# EAGLE board OSO-BOOK-A1-05 (EAGLE 9.4.2)
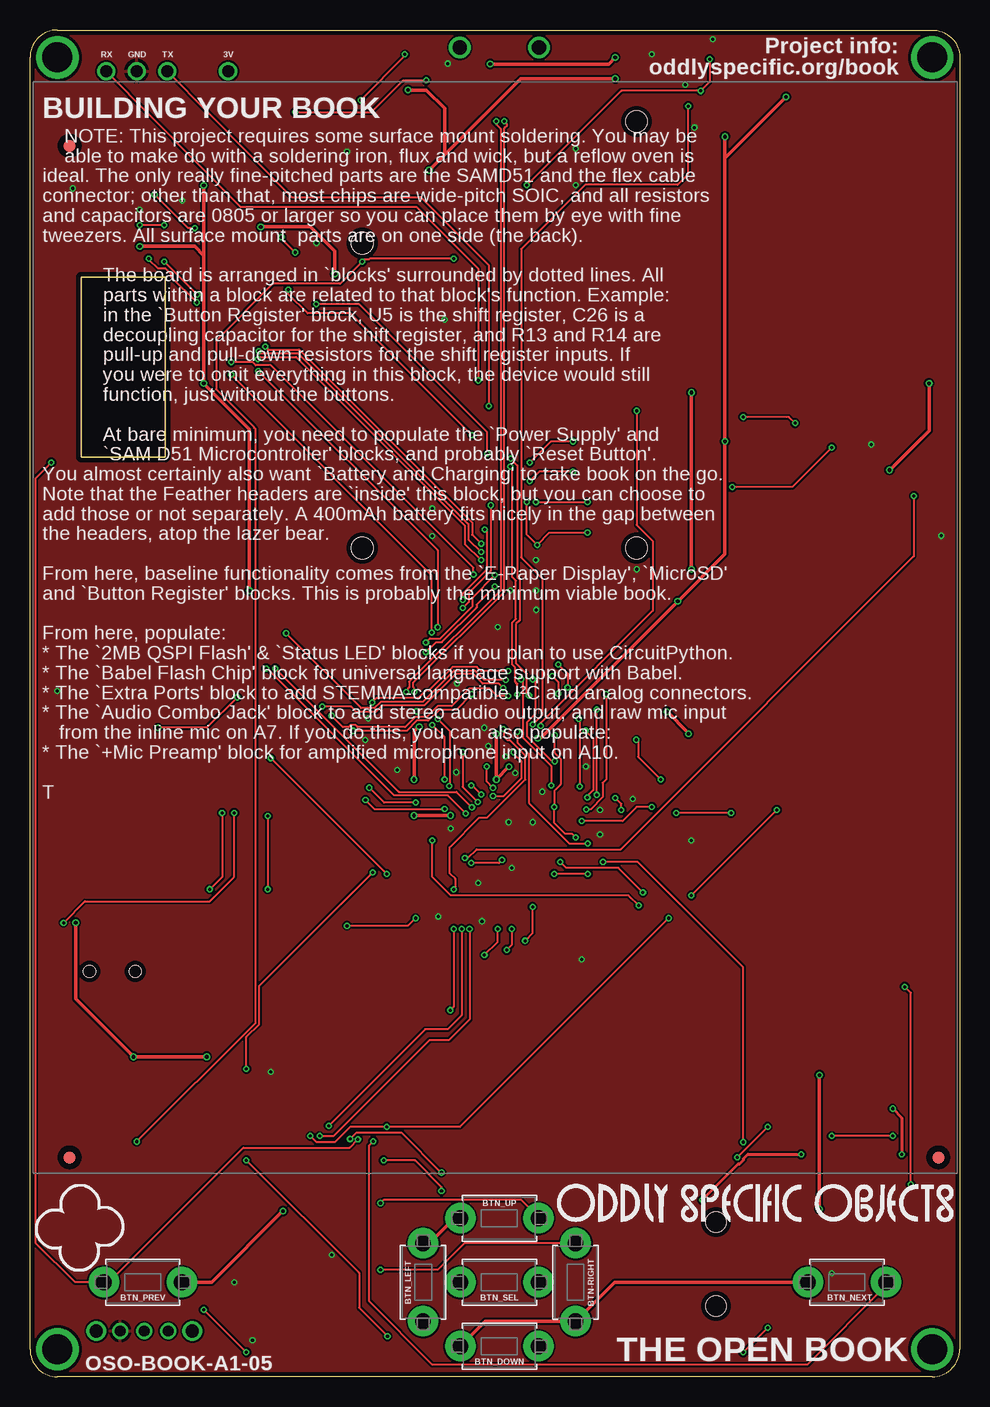
[diagram p3: board, top side]
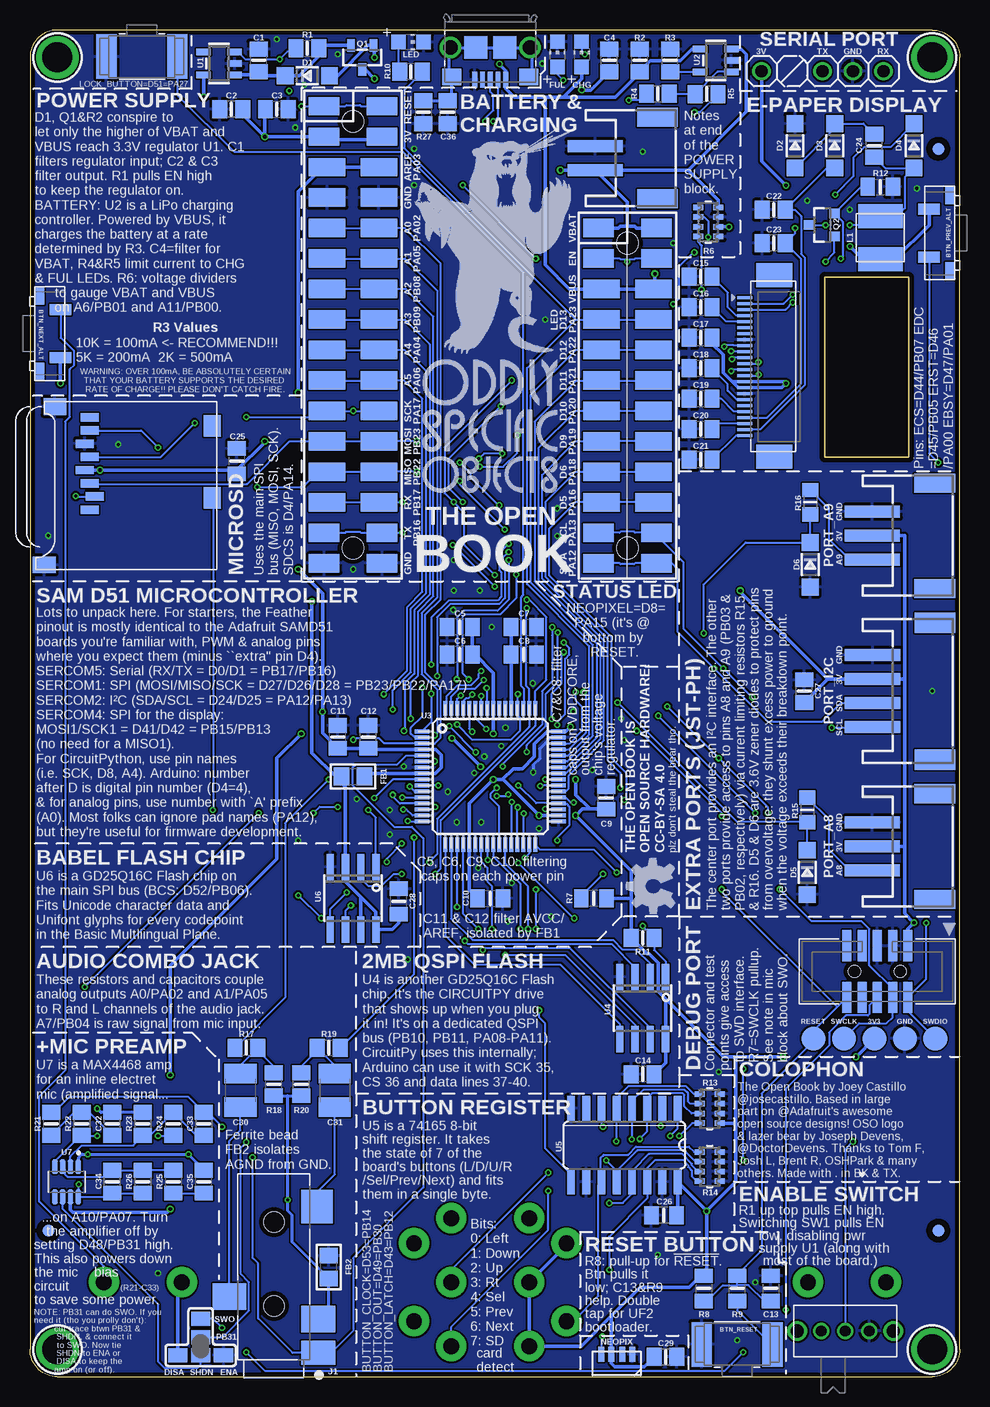
[diagram p4: board, bottom side, seen from below]

Size 77.47 x 112.27 mm. Coordinates in mm from the lower left corner, seen from the top.
Outline: 2.29,112.27 75.18,112.27 arc-90 77.47,109.98 77.47,2.29 arc-90 75.18,0 2.29,0 arc-90 0,2.29 0,109.98 arc-90 2.29,112.27
Copper layers (1*16): Top 0.035559375mm / dielectric 1.6mm / Bottom 0.035559375mm
Design rules "oshpark-2layer *": minimum track width 6mil, minimum drill 10mil, track to track 6mil, track to pad 6mil, pad to pad 6mil, via to via 6mil, smd to smd 6mil, copper to edge 15mil, drill to drill 6mil, minimum pad ring 5mil, minimum via ring 5mil, stop-mask expansion 2.5mil, vias tented up to drill 12mil, thermal gap 10mil
Net classes: 0 default: width 0.152 mm, drill 0.254 mm; 1 power: width 0.305 mm, drill 0.305 mm; 2 gnd: width 0.254 mm, drill 0.254 mm

## Footprints (pad centres in the part's own frame; a part is rotated, then mirrored left to right if it is on the bottom)
TACT_PANA-EVQ = drill 1.3 pad 2.54: P$1 -3.25,0; P$2 3.25,0
BTN_CK_KSS = smd 1.7 x 3.7: P$1 -2.95,0; P$2 2.95,0
0805-NO = smd 1.24 x 1.5: 1 -0.95,0; 2 0.95,0
0805_10MGAP = smd 1.2 x 1.5: 1 -1.05,0; 2 1.05,0
C1210 = smd 1.6 x 2.7: 1 -1.4,0; 2 1.4,0
CHIP-LED0805 = smd 1.2 x 1.2: A 0,-1.05; C 0,1.05
SOD-123 = smd 1.4 x 1.4: A 1.85,0; C -1.85,0
TL3330AF130QG = smd 1.45 x 0.8: MP1 0.75,-2.1; MP2 7.05,-2.1 | smd 0.9 x 1.778: P$1 1.9,-0.346; P$2 5.9,-0.346
0805 = smd 1.3 x 1.5: 1 -0.95,0; 2 0.95,0
FIDUCIAL_1MM = smd 1 x 1: 1 0,0
CUI_SJ-43514-SMT = smd 2 x 2.8: 1 -7.15,-3.7 | smd 2.8 x 2.6: 2 5.05,-3.6 | smd 2.2 x 2.8: 3 -2.45,3.7; 4 -4.35,-3.7 | hole 1.7: -3.25,0; 3.75,0
FCI_10118193-0001LF = smd 0.4 x 1.35: 1 -1.3,2.675; 2 -0.65,2.675; 3 0,2.675; 4 0.65,2.675; 5 1.3,2.675 | smd 1.6 x 1.4: S1 -3.2,2.45; S2 3.2,2.45 | smd 1.9 x 1.9: S3 1.2,0; S4 -1.2,0 | drill 1.2: S5 3.302,0; S6 -3.302,0
1X03 = drill 1.016: 1 -2.54,0; 2 0,0; 3 2.54,0
1X01 = drill 1.016: 1 0,0
MICROBUILDER_INDUCTOR_4X4MM_NR401_BIGPADS = smd 2 x 3.7: P$1 -1.8,0; P$2 1.8,0
MICROSD = smd 0.7 x 1.5: 1 9,-10.64; 2 7.9,-10.24; 3 6.8,-10.64; 4 5.7,-11.04; 5 4.6,-10.64; 6 3.5,-11.04; 7 2.4,-10.64; 8 1.3,-10.64 | smd 1.8 x 1.4: CD1 2,-0.44; CD2 8,-0.44 | smd 1.4 x 1.9: MT1 0.4,-13.54; MT2 13.6,-14.44
FEATHERWING_SMT2 = smd 1.524 x 2.54: 1 6.35,2.413; 1' 6.35,-2.413; 2 8.89,2.413; 2' 8.89,-2.413; 15 41.91,2.413; 15' 41.91,-2.413; 16 44.45,2.413; 16' 44.45,-2.413; 17 44.45,20.447; 17' 44.45,25.273; 18 41.91,20.447; 18' 41.91,25.273; 27 19.05,20.447; 27' 19.05,25.273; 28 16.51,20.447; 28' 16.51,25.273 | smd 1.524 x 3.048: 3 11.43,2.159; 3' 11.43,-2.159; 4 13.97,2.159; 4' 13.97,-2.159; 5 16.51,2.159; 5' 16.51,-2.159; 6 19.05,2.159; 6' 19.05,-2.159; 7 21.59,2.159; 7' 21.59,-2.159; 8 24.13,2.159; 8' 24.13,-2.159; 9 26.67,2.159; 9' 26.67,-2.159; 10 29.21,2.159; 10' 29.21,-2.159; 11 31.75,2.159; 11' 31.75,-2.159; 12 34.29,2.159; 12' 34.29,-2.159; 13 36.83,2.159; 13' 36.83,-2.159; 14 39.37,2.159; 14' 39.37,-2.159; 19 39.37,20.701; 19' 39.37,25.019; 20 36.83,20.701; 20' 36.83,25.019; 21 34.29,20.701; 21' 34.29,25.019; 22 31.75,20.701; 22' 31.75,25.019; 23 29.21,20.701; 23' 29.21,25.019; 24 26.67,20.701; 24' 26.67,25.019; 25 24.13,20.701; 25' 24.13,25.019; 26 21.59,20.701; 26' 21.59,25.019 | hole 1.8: 17.78,22.86; 43.18,22.86; 7.62,0; 43.18,0
WS2812B_4020 = smd 0.5 x 1.25: 1 1.3,-0.75; 2 0.45,-0.75; 3 -0.45,-0.75; 4 -1.3,-0.75
JSTPH3 = smd 1 x 4.6: 1 -2,-2.7; 2 0,-2.7; 3 2,-2.7 | smd 1.6 x 3.4: NC1 -4.4,2.5; NC2 4.4,2.5
JSTPH4 = smd 1 x 4.6: 1 -3,-3.7; 2 -1,-3.7; 3 1,-3.7; 4 3,-3.7 | smd 1.7 x 3.4: NC1 -5.7,1.5; NC2 5.7,1.5
SOT23-R = smd 0.635 x 1.016: 1 -0.95,-1; 2 0.95,-1; 3 0,1
SOT23-3 = smd 0.8 x 0.9: 1 -0.95,-1; 2 0.95,-1; 3 0,1.1
EXBV8V = smd 0.838 x 0.457: 1 -0.838,1.219; 2 -0.838,0.406; 3 -0.838,-0.406; 4 -0.838,-1.219; 5 0.838,-1.219; 6 0.838,-0.406; 7 0.838,0.406; 8 0.838,1.219
_0805MP = smd 1.2 x 1.3: 1 -1.016,0; 2 1.016,0
SOLDERJUMPER_FIVEWAY = smd 1.168 x 1.6: 1 -0.762,0; 2 0.762,0; 3 0.762,-1.905; 4 0.762,1.905; 5 -2.286,0 | smd 0.635 x 0.203: WIRE 0,0
A10767 = drill 1.1: MP1 -4,0; MP2 4,0 | drill 0.9: P$1 -2,0; P$2 0,0; P$3 2,0
TESTPOINT_ROUND_2MM_NO = smd 2 x 2: P$1 0,0
SOT23-5 = smd 0.55 x 1.2: 1 -0.95,-1.3; 2 0,-1.3; 3 0.95,-1.3; 4 0.95,1.3; 5 -0.95,1.3
TQFP64-10X10 = smd 1.2 x 0.3: 1 -5.7,3.75; 2 -5.7,3.25; 3 -5.7,2.75; 4 -5.7,2.25; 5 -5.7,1.75; 6 -5.7,1.25; 7 -5.7,0.75; 8 -5.7,0.25; 9 -5.7,-0.25; 10 -5.7,-0.75; 11 -5.7,-1.25; 12 -5.7,-1.75; 13 -5.7,-2.25; 14 -5.7,-2.75; 15 -5.7,-3.25; 16 -5.7,-3.75; 33 5.7,-3.75; 34 5.7,-3.25; 35 5.7,-2.75; 36 5.7,-2.25; 37 5.7,-1.75; 38 5.7,-1.25; 39 5.7,-0.75; 40 5.7,-0.25; 41 5.7,0.25; 42 5.7,0.75; 43 5.7,1.25; 44 5.7,1.75; 45 5.7,2.25; 46 5.7,2.75; 47 5.7,3.25; 48 5.7,3.75 | smd 0.3 x 1.2: 17 -3.75,-5.7; 18 -3.25,-5.7; 19 -2.75,-5.7; 20 -2.25,-5.7; 21 -1.75,-5.7; 22 -1.25,-5.7; 23 -0.75,-5.7; 24 -0.25,-5.7; 25 0.25,-5.7; 26 0.75,-5.7; 27 1.25,-5.7; 28 1.75,-5.7; 29 2.25,-5.7; 30 2.75,-5.7; 31 3.25,-5.7; 32 3.75,-5.7; 49 3.75,5.7; 50 3.25,5.7; 51 2.75,5.7; 52 2.25,5.7; 53 1.75,5.7; 54 1.25,5.7; 55 0.75,5.7; 56 0.25,5.7; 57 -0.25,5.7; 58 -0.75,5.7; 59 -1.25,5.7; 60 -1.75,5.7; 61 -2.25,5.7; 62 -2.75,5.7; 63 -3.25,5.7; 64 -3.75,5.7
SOIC8_150MIL = smd 0.6 x 2.2: 1 -1.905,-2.6; 2 -0.635,-2.6; 3 0.635,-2.6; 4 1.905,-2.6; 5 1.905,2.6; 6 0.635,2.6; 7 -0.635,2.6; 8 -1.905,2.6
SO16 = smd 0.66 x 2.032: 1 -4.445,-3.073; 2 -3.175,-3.073; 3 -1.905,-3.073; 4 -0.635,-3.073; 5 0.635,-3.073; 6 1.905,-3.073; 7 3.175,-3.073; 8 4.445,-3.073; 9 4.445,3.073; 10 3.175,3.073; 11 1.905,3.073; 12 0.635,3.073; 13 -0.635,3.073; 14 -1.905,3.073; 15 -3.175,3.073; 16 -4.445,3.073
MICROBUILDER_SOIC8_150MIL = smd 0.6 x 2.2: 1 -1.905,-2.6; 2 -0.635,-2.6; 3 0.635,-2.6; 4 1.905,-2.6; 5 1.905,2.6; 6 0.635,2.6; 7 -0.635,2.6; 8 -1.905,2.6
SOT65P280X145-8N = smd 1.21 x 0.48: 1 -1.255,0.975; 2 -1.255,0.325; 3 -1.255,-0.325; 4 -1.255,-0.975; 5 1.255,-0.975; 6 1.255,-0.325; 7 1.255,0.325; 8 1.255,0.975
MOUNTINGHOLE_2.5_PLATED = drill 2.5 pad 3.2: P$1 0,0
EINK_DISPLAY_4_2IN = smd 1.25 x 0.275 bottom: 1 17.653,-16.717; 2 17.653,-17.217; 3 17.653,-17.717; 4 17.653,-18.217; 5 17.653,-18.717; 6 17.653,-19.217; 7 17.653,-19.717; 8 17.653,-20.217; 9 17.653,-20.717; 10 17.653,-21.217; 11 17.653,-21.717; 12 17.653,-22.217; 13 17.653,-22.717; 14 17.653,-23.217; 15 17.653,-23.717; 16 17.653,-24.217; 17 17.653,-24.717; 18 17.653,-25.217; 19 17.653,-25.717; 20 17.653,-26.217; 21 17.653,-26.717; 22 17.653,-27.217; 23 17.653,-27.717; 24 17.653,-28.217 | smd 3 x 2 bottom: SPRT1 15.193,-14.867; SPRT2 15.193,-29.977
JSTPH2 = smd 1 x 4.6: 1 -1,-3.7; 2 1,-3.7 | smd 1.6 x 3.4: NC1 -3.4,1.5; NC2 3.4,1.5
2X05_1.27MM_BOX_POSTS = smd 0.76 x 2.6: 1 -2.54,-2.15; 2 -2.54,2.15; 3 -1.27,-2.15; 4 -1.27,2.15; 5 0,-2.15; 6 0,2.15; 7 1.27,-2.15; 8 1.27,2.15; 9 2.54,-2.15; 10 2.54,2.15 | hole 1: -1.905,0; 1.905,0

## Placement (x,y rotation side)
BTN-RIGHT  [TACT_PANA-EVQ]  45.47,7.87 270 top
BTN_DOWN  [TACT_PANA-EVQ]  39.12,2.54 180 top
BTN_LEFT  [TACT_PANA-EVQ]  32.77,7.87 90 top
BTN_LOCK  [BTN_CK_KSS]  68.15,110.06 180 bottom
BTN_NEXT  [TACT_PANA-EVQ]  68.07,7.87 180 top
BTN_PREV  [TACT_PANA-EVQ]  9.4,7.87 0 top
BTN_RESET  [BTN_CK_KSS]  18.54,2.69 0 bottom
BTN_SEL  [TACT_PANA-EVQ]  39.12,7.87 180 top
BTN_UP  [TACT_PANA-EVQ]  39.12,13.21 180 top
C1  10µF  [0805-NO]  58.42,109.73 90 bottom
C2  10µF  [0805-NO]  60.71,105.66 180 bottom
C3  1uF  [0805-NO]  56.9,105.66 0 bottom
C4  10µF  [0805-NO]  29.21,109.73 90 bottom
C5  10uF  [0805_10MGAP]  41.66,62.48 180 bottom
C6  1uF  [0805_10MGAP]  41.66,60.2 180 bottom
C7  10uF  [0805_10MGAP]  36.32,62.48 0 bottom
C8  1uF  [0805_10MGAP]  36.32,60.2 0 bottom
C9  1uF  [0805-NO]  29.46,48.26 90 bottom
C10  1uF  [0805_10MGAP]  39.12,39.88 0 bottom
C11  10µF  [0805-NO]  51.82,53.34 90 bottom
C12  1uF  [0805-NO]  49.28,53.34 90 bottom
C13  0.1uF  [0805_10MGAP]  15.75,7.37 270 bottom
C14  1uF  [0805-NO]  26.42,25.22 180 bottom
C15  1uF  [0805-NO]  21.59,91.69 0 bottom
C16  1uF  [0805-NO]  21.59,89.15 0 bottom
C17  1uF  [0805-NO]  21.59,86.61 0 bottom
C18  1uF/25V  [0805-NO]  21.59,84.07 0 bottom
C19  1uF/25V  [0805-NO]  21.59,81.53 0 bottom
C20  1uF/25V  [0805-NO]  21.59,78.99 0 bottom
C21  1uF/25V  [0805-NO]  21.59,76.45 0 bottom
C22  1uF/25V  [0805-NO]  15.49,97.28 180 bottom
C23  1uF/25V  [0805-NO]  15.49,94.49 180 bottom
C24  4.7uF/25V  [0805-NO]  7.11,102.62 90 bottom
C25  10uF  [0805_10MGAP]  60.22,76.33 90 bottom
C26  1uF  [0805_10MGAP]  24.64,13.46 180 bottom
C27  10uF  [0805-NO]  12.95,57.15 90 bottom
C28  1uF  [0805_10MGAP]  46.74,39.62 90 bottom
C29  1uF  [0805-NO]  24.51,1.65 0 bottom
C30  100uF  [C1210]  59.94,23.88 270 bottom
C31  100uF  [C1210]  52.07,23.88 270 bottom
C32  0.1µF  [0805-NO]  70.61,21.08 90 bottom
C33  0.01uF  [0805-NO]  62.99,21.08 270 bottom
C34  100pF  [0805-NO]  70.61,16.26 90 bottom
C35  10uF  [0805-NO]  62.99,16.26 90 bottom
C36  4.5nF  [0805-NO]  42.67,105.41 270 bottom
CHG  AMBER  [CHIP-LED0805]  31.5,110.24 0 bottom
D1  MBR120  [SOD-123]  54.36,108.46 0 bottom
D2  MBR0530  [SOD-123]  13.72,102.62 270 bottom
D3  MBR0530  [SOD-123]  10.41,102.62 270 bottom
D4  MBR0530  [SOD-123]  3.81,102.62 270 bottom
D5  3.6V  [SOD-123]  12.7,42.04 270 bottom
D6  3.6V  [SOD-123]  12.45,67.69 270 bottom
DNP_NEXT_ALT  SPST_TACTILE_SWITCHRA  [TL3330AF130QG]  74.57,90.86 270 bottom
DNP_PREV_ALT  SPST_TACTILE_SWITCHRA  [TL3330AF130QG]  2.9,91.44 90 bottom
FB1  Ferrite  [0805]  50.55,50.04 0 bottom
FB2  Ferrite  [0805]  52.58,9.14 90 bottom
FID1  FIDUCIAL_1MM  [FIDUCIAL_1MM]  75.95,12.19 0 bottom
FID2  FIDUCIAL_1MM  [FIDUCIAL_1MM]  75.69,18.29 0 top
FID3  FIDUCIAL_1MM  [FIDUCIAL_1MM]  1.78,102.36 0 bottom
FID4  FIDUCIAL_1MM  [FIDUCIAL_1MM]  3.3,102.62 0 top
FID5  FIDUCIAL_1MM  [FIDUCIAL_1MM]  1.78,12.19 0 bottom
FID6  FIDUCIAL_1MM  [FIDUCIAL_1MM]  3.3,18.29 0 top
FUL  GREEN  [CHIP-LED0805]  33.53,110.24 0 bottom
GOLD_ORB_SM1  OSHWLOGOLOGO5MM  [OSHW_5MM]  25.53,40.89 90 bottom
J1  SJ-43514-SMT  [CUI_SJ-43514-SMT]  57.15,9.14 90 bottom
J2  10118193-0001LF  [FCI_10118193-0001LF]  39.12,110.81 180 bottom
JP1  [1X03]  8.89,108.84 0 bottom
JP2  [1X01]  16.51,108.84 0 bottom
L1  10uH  [MICROBUILDER_INDUCTOR_4X4MM_NR401_BIGPADS]  6.6,94.95 90 bottom
LED  RED  [CHIP-LED0805]  45.72,111.25 270 bottom
MICROSD  MICROSD  [MICROSD]  61.85,81.28 270 bottom
MS1  FEATHERWING_SMTDUAL  [FEATHERWING_SMT2]  50.55,112.27 270 bottom
NEOPIX  WS2812B_4020  [WS2812B_4020]  28.58,1.12 180 bottom
PORT_A8  JST PH 3  [JSTPH3]  4.57,44.2 270 bottom
PORT_A9  JST PH 3  [JSTPH3]  4.57,70.1 270 bottom
PORT_I2C  JST PH 4  [JSTPH4]  3.56,57.15 270 bottom
Q1  DMG341  [SOT23-R]  49.78,109.98 180 bottom
Q2  IRLML0100  [SOT23-3]  11.43,96.01 90 bottom
R1  10K  [0805-NO]  54.36,110.74 0 bottom
R2  100K  [0805-NO]  26.67,109.73 90 bottom
R3  10K  [0805-NO]  24.13,109.73 90 bottom
R4  1K  [0805-NO]  25.15,106.96 0 bottom
R5  1K  [0805-NO]  21.08,106.93 180 bottom
R6  100K  [EXBV8V]  20.96,96.27 0 bottom
R7  10K  [0805_10MGAP]  30.48,39.88 180 bottom
R8  10K  [0805_10MGAP]  21.34,7.37 270 bottom
R9  100  [0805_10MGAP]  18.54,7.37 90 bottom
R10  1K  [0805-NO]  45.72,108.79 180 bottom
R11  100K  [0805-NO]  26.42,36.58 0 bottom
R12  0.47ohm  [0805_10MGAP]  6.6,99.19 0 bottom
R13  100K  [EXBV8V]  20.83,22.35 0 bottom
R14  100K  [EXBV8V]  20.83,17.53 0 bottom
R15  1K  [_0805MP]  12.7,47.24 270 bottom
R16  1K  [_0805MP]  12.45,72.9 270 bottom
R17  100  [0805-NO]  59.44,27.43 180 bottom
R18  100  [0805-NO]  57.15,24.38 90 bottom
R19  100  [0805-NO]  52.58,27.43 0 bottom
R20  100  [0805-NO]  54.86,24.38 90 bottom
R21  1K  [0805-NO]  75.69,21.08 270 bottom
R22  1K  [0805-NO]  73.15,21.08 270 bottom
R23  1M  [0805-NO]  68.07,21.08 270 bottom
R24  1M  [0805-NO]  65.53,21.08 270 bottom
R25  1K  [0805-NO]  65.53,16.26 270 bottom
R26  100K  [0805-NO]  68.07,16.26 270 bottom
R27  1M  [0805-NO]  44.7,105.41 270 bottom
SJ1  SOLDERJUMPER_FIVEWAY  [SOLDERJUMPER_FIVEWAY]  63.25,2.54 270 bottom
SW1  SPDT_SWITCH  [A10767]  9.53,3.81 0 bottom
TP1  [TESTPOINT_ROUND_2MM_NO]  4.57,28.19 180 bottom
TP2  [TESTPOINT_ROUND_2MM_NO]  7.11,28.19 180 bottom
TP6  [TESTPOINT_ROUND_2MM_NO]  9.65,28.19 180 bottom
TP7  [TESTPOINT_ROUND_2MM_NO]  2.03,28.19 180 bottom
TP8  [TESTPOINT_ROUND_2MM_NO]  12.19,28.19 180 bottom
U1  AP2112-3.3  [SOT23-5]  61.72,109.47 90 bottom
U2  MCP73831T-2ACI/OT  [SOT23-5]  20.32,109.73 90 bottom
U3  ATSAMD51J64-TQFP(10X10)  [TQFP64-10X10]  39.12,50.04 0 bottom
U4  GD25Q16C (or GD25Q32C)  [SOIC8_150MIL]  26.42,30.73 180 bottom
U5  74AC165D  [SO16]  27.94,19.3 180 bottom
U6  GD25Q16C (or GD25Q32C)  [MICROBUILDER_SOIC8_150MIL]  50.55,39.88 180 bottom
U7  MAX4468EKAT  [SOT65P280X145-8N]  74.42,16.26 270 bottom
U$1  MOUNTINGHOLE2.5  [MOUNTINGHOLE_2.5_PLATED]  2.29,2.29 0 bottom
U$2  WAVESHARE_4_2_INCH_EINK_DISPLAY  [EINK_DISPLAY_4_2IN]  0.25,106.68 0 top
U$4  MOUNTINGHOLE2.5  [MOUNTINGHOLE_2.5_PLATED]  75.18,2.29 0 bottom
U$5  MOUNTINGHOLE2.5  [MOUNTINGHOLE_2.5_PLATED]  2.29,109.98 0 bottom
U$7  MOUNTINGHOLE2.5  [MOUNTINGHOLE_2.5_PLATED]  75.18,109.98 0 bottom
U$45  [OSO_WORDMARK_125X1300MIL_1000DPI]  43.94,14.48 0 top
U$47  [OSO_BEAR_525X750MIL_1000DPI]  38.86,94.74 0 bottom
U$48  [OSO-LOGO-250MIL]  4.06,12.45 45 top
U$49  [OSO_WORDMARK_THREELINE_450MIL_1000DPI]  39.12,79.25 0 bottom
X1  JSTPH  [JSTPH2]  26.67,101.6 270 bottom
X2  2x5 0.05" SWD  [2X05_1.27MM_BOX_POSTS]  6.86,33.78 180 bottom

## Tracks (layer width: path | path; a pad name or v marks a point on that pad's centre or on a via)
!RESET  (via drill 0.25)
  Top 0.152: v41.88,54.36 42.67,55.14 42.67,66.55 40.92,68.3 40.92,94 46.27,99.35 53.96,99.35 54.86,100.25 v54.86,105.92 | v36.81,56.9 35.51,55.6 34.09,55.6 33.17,54.69 32.23,54.69 31.39,53.85 v26.92,53.85 | v19.81,46.74 v19.81,40.64
  Bottom 0.152: MS1.1 49.9,105.92 49.98,106 51.11,106 51.2,105.92 MS1.1' v54.86,105.92 | v41.88,54.36 40.61,53.09 37.41,53.09 36.63,53.87 36.63,54.91 36.87,55.15 U3.52 36.81,55.8 v36.81,56.9 | v26.92,53.85 26.67,53.85 19.81,46.99 v19.81,46.74 | v19.81,40.64 19.81,40.43 10.21,30.82 X2.10 12.19,28.84 TP8.P$1 12.19,27.94 16.51,23.62 16.51,10.55 18.54,8.52 R9.2 18.54,7.64 | R8.2 21.05,6.32 20.03,7.33 19.98,7.38 19.73,7.64 18.54,7.64 | C13.2 16.28,6.32 17.6,7.64 18.54,7.64
+3V3  (via drill 0.3)
  Top 0.305: v14.73,26.67 v8.64,26.67 3.81,31.5 v3.81,37.85 | v18.29,65.53 18.29,78.99 v14.48,82.8 14.48,93.47 | v9.14,94.23 13.72,94.23 14.48,93.47 | v42.32,53.24 42.57,53.24 v53.97,64.64 57.91,68.58 v57.91,77.98 57.91,101.6 | v39.91,50.86 38.86,49.81 v38.86,49.78 v38.86,53.59 | v32.44,54.18 32.33,54.18 32,53.85 v32,49.78 | v32,46.79 v35.05,46.79 | v14.48,99.31 14.48,93.47 | v74.93,82.8 74.93,78.88 v71.63,75.58 | 57.91,101.6 v62.99,106.68 | 57.91,101.6 v57.91,103.38 | v21.08,13.82 15.14,7.87 BTN_PREV.P$2 | BTN_LEFT.P$2 33.27,11.12 35.36,13.21 BTN_UP.P$2 | BTN_DOWN.P$2 37.95,4.62 BTN-RIGHT.P$2 48.72,7.87 BTN_NEXT.P$2
  Bottom 0.305: v57.91,77.98 57.91,77.88 60.22,75.56 C25.1 60.53,75.58 v71.63,75.58 MICROSD.4 | v38.86,53.59 U3.56 38.87,58.68 40.39,60.2 C6.1 C5.1 | U3.34 v35.05,46.79 38.05,49.78 38.1,49.78 | v53.97,64.64 53.97,52.01 52,50.04 FB1.1 51.5,49.49 51.18,49.18 U6.3 51.18,41.27 49.91,40.01 | 27.37,39.88 27.37,42.15 v32,46.79 31.95,46.79 31.43,47.31 C9.1 30.8,47.31 32,48.51 v32,49.78 | 27.37,39.88 R11.1 26.04,35.25 25.86,35.25 25.12,34.5 25.12,32.11 24.51,31.5 | 24.51,31.5 U4.8 24.51,26.18 C14.1 | 18.66,26.67 19.68,26.67 24.51,31.5 | 18.66,26.67 v14.73,26.67 | TP2.P$1 v8.64,26.67 | X2.1 4.32,37.34 v3.81,37.85 4.59,38.62 4.59,44.2 | 4.59,44.2 4.59,58.17 | 4.59,58.17 4.59,70.1 PORT_A9.2 | C27.1 11,58.15 | 11,58.15 PORT_I2C.2 7.24,58.17 4.59,58.17 | PORT_A8.2 4.59,44.2 | 11,58.15 18.29,65.43 v18.29,65.53 | 18.96,82.96 18.46,82.46 U$2.16 14.82,82.46 v14.48,82.8 14.64,82.96 U$2.15 18.96,82.96 | C17.2 20.64,86.13 19.7,85.19 19.7,83.71 18.96,82.96 | v42.32,53.24 42.29,53.24 v39.91,50.86 | 38.1,49.78 37.21,50.67 36.45,50.67 35.43,51.69 35.43,52.73 34.38,53.79 U3.48 32.83,53.79 v32.44,54.18 | 18.66,26.67 18.66,21.13 | 18.66,21.13 18.66,16.24 v21.08,13.82 | 38.1,49.78 v38.86,49.78 40.87,47.78 U3.21 40.87,40.58 C10.1 | JP2.1 16.51,101.35 v14.48,99.31 | C3.1 57.91,105.73 v57.91,103.38 | MS1.2 48.39,103.12 52.7,103.12 MS1.2' v57.91,103.38 | C26.1 23.5,13.55 U5.16 v21.08,13.82 | DNP_NEXT_ALT.P$2 74.93,84.95 v74.93,82.8 | DNP_PREV_ALT.P$2 2.55,96 5.41,93.14 L1.P$1 8.05,93.14 v9.14,94.23 | R13.5 18.66,21.13 | v62.99,106.68 62.99,108.49 U1.5 | C2.1 59.85,105.76 59.85,105.32 v57.91,103.38 | v21.08,13.82 21.08,8.16 R8.1 21.59,8.42 22.54,7.47 26.62,7.47 29.02,5.07
  Bottom 0.305: R7.1 27.37,39.88 | 49.91,40.01 48.64,38.73 U6.8 47.27,37.28 46.74,37.81 C28.1 | U6.7 49.91,40.01 | BTN_LEFT.P$2 32.77,10.97 BTN_SEL.P$2 BTN_DOWN.P$2 31.55,2.54 29.02,5.07 | BTN_NEXT.P$2 65.15,7.54 SJ1.3 | 29.02,5.07 NEOPIX.2 29.03,1.14 28.72,0.84 26.27,0.84 C29.1
A0  (via drill 0.25)
  Top 0.152: v52.58,49.78 50.68,51.68 50.68,52.95 v50.53,53.1
  Bottom 0.152: MS1.5' MS1.5 46.23,95.76 43.24,92.78 43.24,64.81 44.52,63.53 44.52,58.69 43.24,57.42 43.24,53.27 43.73,52.79 U3.3 44.77,52.83 48.01,52.83 48.41,53.24 50.39,53.24 v50.53,53.1 | v52.58,49.78 56.2,46.16 56.2,31.62 R17.2
A1  (via drill 0.25)
  Top 0.152: v43.73,53.48 43.69,53.44 43.69,52.04 44.22,51.51 44.22,49.38 43.69,48.85 v43.69,47.5 43.69,46.16 44.59,45.25 45.17,45.25 v45.47,44.96
  Bottom 0.152: MS1.6' MS1.6 46.23,93.22 43.55,90.54 43.55,64.94 44.83,63.66 44.83,58.57 43.55,57.29 43.55,53.65 v43.73,53.48 | v43.69,47.5 43.9,47.29 U3.14 | R19.2 45.47,33.59 v45.47,44.96
A2  (via drill 0.25)
  Top 0.152: v45.73,54.85 45.82,54.76 v45.82,49.2
  Bottom 0.152: MS1.7' MS1.7 46.14,90.68 43.85,88.39 43.85,65.06 45.13,63.78 45.13,58.48 45.73,57.87 v45.73,54.85 | U3.11 45.41,48.79 v45.82,49.2
A3  (via drill 0.25)
  Top 0.152: v46.3,53.85 46.94,53.21 46.94,48.9 46.46,48.41 v46.46,48.28
  Bottom 0.152: MS1.8' MS1.8 46.23,88.14 44.16,86.07 44.16,65.19 45.44,63.91 45.44,58.6 46.23,57.81 46.23,53.92 v46.3,53.85 | v46.46,48.28 U3.12
A4  (via drill 0.25)
  Top 0.152: v47.24,48.51 v47.24,55.63
  Bottom 0.152: MS1.9' MS1.9 46.24,85.6 44.46,83.82 44.46,65.31 45.74,64.04 45.74,58.73 47.24,57.23 v47.24,55.63 | U3.13 46.64,47.79 47.24,48.39 v47.24,48.51
A5  (via drill 0.25)
  Top 0.152: v46.37,47.3 46.72,47.3 47.73,48.31 47.73,49.51 48.01,49.78 v48.01,56.9
  Bottom 0.152: MS1.10' MS1.10 46.29,83.06 44.77,81.53 44.77,65.44 46.04,64.16 46.04,58.86 v48.01,56.9 | U3.15 45.58,46.79 46.09,47.3 v46.37,47.3
A6_BATMON  (via drill 0.25)
  Top 0.152: v41.58,56.8 41.4,56.98 41.4,58.59 40.49,59.51 40.49,62.74 40.79,63.04 40.79,66.5 40.61,66.67 40.61,75.97 v40.06,76.53 | v20.96,95 20.96,94.87 v22.1,93.73 | v23.85,89.41 27.43,89.41 38.1,78.74 38.1,76.98 v38.12,76.96
  Bottom 0.152: U3.62 41.87,56.51 v41.58,56.8 | v38.12,76.96 39.62,76.96 v40.06,76.53 | v23.85,89.41 23.39,89.86 23.39,92.53 22.2,93.73 v22.1,93.73 | v20.96,95 20.96,96.34 21.29,96.67 R6.2 R6.1
A7_MIC  (via drill 0.25)
  Top 0.152: v61.47,20.83 v58.93,18.29
  Bottom 0.152: U3.5 46.13,51.79 46.9,51.02 50.34,51.02 50.6,50.76 50.6,49.31 47.13,45.85 45.64,45.85 44.68,44.88 44.68,15.77 50.55,9.91 50.55,3.81 52.36,1.99 J1.1 55.59,1.99 58.46,4.86 58.46,9.44 58.93,9.91 v58.93,18.29 | v61.47,20.83 62.67,22.03 C33.1 64.33,23.37 74.17,23.37 75.5,22.03 R21.1
A8_
  Bottom 0.152: R15.1 10.92,46.48 10.92,43.94 9.18,42.2 PORT_A8.3
A9_
  Bottom 0.152: PORT_A9.3 9.18,68.1 10.92,69.85 10.92,72.39 R16.1
A10_MICAMP  (via drill 0.25)
  Top 0.152: v58.42,46.99 v53.85,46.99 | v51.82,47.5 50.55,47.5 49.38,46.33 v45.97,46.33 | v73.41,16.03 73.41,32 v72.9,32.51
  Bottom 0.152: v45.97,46.33 45.93,46.29 U3.16 | v53.85,46.99 53.34,47.5 v51.82,47.5 | R26.2 C34.1 70.92,15 U7.8 73.41,15.04 v73.41,16.03 | v72.9,32.51 v58.42,46.99
A11_BUSMON  (via drill 0.25)
  Top 0.152: v40.61,56.87 40.61,57.76 40.44,57.94 40.44,59.13 40.18,59.38 40.18,62.86 40.49,63.17 40.49,66.37 40.18,66.68 40.18,75.69 v40,75.87 | v36.83,78.49 26.67,88.65 23.13,88.65 21.51,90.27 v21.51,90.62
  Bottom 0.152: R6.3 R6.4 21.79,94.61 21.49,94.31 21.49,90.65 v21.51,90.62 | v40.61,56.87 40.92,56.57 41.11,56.57 41.37,56.31 U3.61 | v36.83,78.49 36.87,78.44 36.87,77.02 38.02,75.87 v40,75.87
AGND  (via drill 0.25)
  Top 0.254: v64.26,18.54 59.82,18.54 59.46,18.19 59.46,18.07 59.15,17.75 59.03,17.75 v56.01,14.73 | v71.88,22.35 72.64,21.59 v72.64,18.54
  Bottom 0.254: R18.1 56.01,23.43 | 56.01,23.43 R20.1 | J1.4 52.58,5.67 FB2.1 55.63,11.24 55.63,13.46 56.01,13.84 v56.01,14.73 56.01,23.43 | R23.1 68.07,22.1 70.55,22.1 C32.2 71.56,22.03 v71.88,22.35 | C35.2 62.99,17.27 v64.26,18.54 v72.64,18.54 73.15,18.54 73.41,18.29 73.41,17.55 U7.1
AUDIO_LEFT
  Bottom 0.152: J1.2 53.55,15.41 52.07,16.89 C31.2
AUDIO_RIGHT
  Bottom 0.152: C30.2 59.94,20.55 60.85,19.65 J1.3
AVCC  (via drill 0.3)
  Top 0.305: v55.12,67.31 v55.12,82.04 | v53.09,55.44 54.86,53.66 v54.86,53.59 | v65.79,13.97 v65.79,25.15
  Bottom 0.305: FB1.2 49.35,50.29 U3.8 43.69,50.29 43.18,50.8 43.18,51.82 43.65,52.29 U3.4 49.17,52.29 C12.1 C11.1 53.09,53.66 v53.09,55.44 53.09,65.28 v55.12,67.31 | MS1.3 MS1.3' 53.09,100.84 55.12,98.81 v55.12,82.04 | v54.86,53.59 56.9,51.56 56.9,43.18 65.79,34.29 v65.79,25.15 | U7.7 74.1,13.9 73.91,13.72 66.04,13.72 v65.79,13.97
BUTTON0
  Bottom 0.152: R14.1 22.12,18.75 22.55,19.18 26.97,19.18 27.63,18.52 29.66,18.52 29.95,18.23 29.95,16.33 U5.11 30.1,15.98 30.1,6.73 32.21,4.62 BTN_LEFT.P$1
BUTTON1  (via drill 0.25)
  Top 0.152: v29.46,18.03 32.08,18.03 34.29,15.83 v34.29,15.49
  Bottom 0.152: v29.46,18.03 28.58,17.14 | U5.12 28.58,17.14 | 28.58,17.14 26.85,18.87 22.93,18.87 22,17.93 R14.2 | v34.29,15.49 34.29,12.24 42.37,4.16 BTN_DOWN.P$1
BUTTON2  (via drill 0.25)
  Top 0.152: v29.21,14.48 29.46,14.73 40.94,14.73 42.37,13.3 BTN_UP.P$1
  Bottom 0.152: R14.3 21.82,17.12 22.31,17.61 22.31,17.77 23.11,18.56 25.89,18.56 27.18,17.27 27.18,16.36 U5.13 27.3,15.24 28.07,14.48 v29.21,14.48
BUTTON3  (via drill 0.25)
  Top 0.152: v29.21,8.91 33.97,8.91 36.23,11.18 45.41,11.18 BTN-RIGHT.P$1
  Bottom 0.152: v29.21,8.91 29.21,11.68 26.04,14.86 U5.14 26.04,17.4 25.37,18.06 23.04,18.06 22.62,17.64 22.62,17.48 22.31,17.18 22.31,16.73 21.89,16.31 R14.4
BUTTON4  (via drill 0.25)
  Top 0.152: v34.29,17.02 30.99,20.32 27.18,20.32 v26.67,19.81
  Bottom 0.152: v26.67,19.81 26.04,20.45 U5.3 26.04,23.24 25.65,23.62 23.07,23.62 22.94,23.49 22.94,22.55 22.33,21.95 R13.3 | v34.29,17.02 34.37,16.94 34.37,16.93 42.37,8.93 BTN_SEL.P$1
BUTTON5  (via drill 0.25)
  Top 0.152: v1.78,76.2 0.46,74.88 0.46,11.18 3.76,7.87 BTN_PREV.P$1 6.56,7.87 17.79,19.1 26.64,19.1 v27.33,19.79
  Bottom 0.152: R13.2 22.46,22.76 22.63,22.93 22.63,23.61 22.94,23.93 26.37,23.93 27.3,22.99 U5.4 27.3,19.82 v27.33,19.79 | DNP_PREV_ALT.P$1 2.55,76.97 v1.78,76.2
BUTTON6  (via drill 0.25)
  Top 0.152: v28.61,19.62 28.23,19.24 28.23,6.31 33.53,1.02 64.77,1.02 71.32,7.57 BTN_NEXT.P$1
  Bottom 0.152: DNP_NEXT_ALT.P$1 74.92,86.62 73.8,85.5 73.8,84.33 74.14,83.99 74.14,80.01 74.55,79.6 74.55,25.53 76.71,23.37 76.71,14.61 71.32,9.22 BTN_NEXT.P$1 | v28.61,19.62 28.61,22.34 U5.5 28.45,22.5 28.45,23.37 27.58,24.23 22.82,24.23 22.16,23.57 R13.1
BUTTON7  (via drill 0.25)
  Top 0.152: v23.37,20.07 23.88,19.56 25.4,19.56 26.67,20.83 v29.72,20.83 35.81,20.83 v53.21,38.23 | v62.23,47.24 v55.12,40.13
  Bottom 0.152: U5.6 29.85,20.95 v29.72,20.83 | R13.4 22.3,21.13 v23.37,20.07 | MICROSD.CD2 62.21,73.2 62.21,47.28 62.23,47.26 v62.23,47.24 | v55.12,40.13 v53.21,38.23
BUTTON_CLK  (via drill 0.25)
  Top 0.152: v35.97,37.34 35.97,30.12 34.8,28.96 32.92,28.96 v24.89,20.93
  Bottom 0.152: v24.89,20.93 24.89,22.25 U5.2 | U3.27 37.87,42.79 35.97,40.89 v35.97,37.34
BUTTON_LATCH  (via drill 0.25)
  Top 0.152: v36.63,37.34 36.63,29.77 34.92,28.07 33.3,28.07 25.3,20.07 v24.13,20.07
  Bottom 0.152: v24.13,20.07 23.5,20.7 U5.1 | U3.25 38.87,43.36 36.63,41.12 v36.63,37.34
BUTTON_OUT  (via drill 0.25)
  Top 0.152: v39.44,53.99 39.47,53.95 39.47,53.37 39.75,53.09 39.98,53.09 41.27,51.79 41.27,49.78 38.1,46.61 37.44,46.61 34.98,44.14 34.98,41.97 35.42,41.52 35.42,40.73 v35.31,40.62 | v35.31,37.34 35.31,30.84 v35.03,30.56
  Bottom 0.152: U3.59 40.37,54.91 v39.44,53.99 | v35.03,30.56 35.03,29.95 34.54,29.46 34.54,19.05 32.38,16.89 U5.9 | v35.31,40.62 v35.31,37.34
BUTTONLOCK
  Bottom 0.152: U3.51 36.32,55.78 36.32,57.37 36.54,57.59 36.54,64.97 36.35,65.17 36.35,92.05 46.38,102.08 60.43,102.08 65.15,106.81 65.2,106.85 BTN_LOCK.P$1
D2_A8  (via drill 0.25)
  Top 0.152: v39.86,58.83 37.59,58.83 37.24,59.18 35.23,59.18 33.23,57.19 32.98,57.19 32.37,56.58 28.87,56.58 v28.51,56.22
  Bottom 0.152: v39.86,58.83 40.11,58.57 40.11,58.27 40.72,57.66 41.83,57.66 42.74,56.75 42.74,55.86 U3.64 | v28.51,56.22 18.52,46.23 R15.2 D5.C
D3_A9  (via drill 0.25)
  Top 0.152: v39.65,58.09 37.85,58.09 37.06,58.88 35.35,58.88 32.74,56.26 29.23,56.26 28.7,55.73 27.58,55.73 v21.34,61.98
  Bottom 0.152: v21.34,61.98 21.34,66.04 17.84,69.54 D6.C R16.2 | v39.65,58.09 40.39,57.35 41.71,57.35 42.37,56.69 U3.63
D5  (via drill 0.25)
  Top 0.152: v27.96,48.07 28.74,47.3 34.49,47.3 v34.54,47.35
  Bottom 0.152: MS1.19' MS1.19 32,72.9 34.19,70.71 34.19,66.8 29.01,61.62 29.01,51.54 27.79,50.32 27.79,48.24 v27.96,48.07 | U3.35 34.48,47.29 v34.54,47.35
D6  (via drill 0.25)
  Top 0.152: v32.14,47.87 29.51,47.87 v28.27,49.1
  Bottom 0.152: MS1.20' MS1.20 32,75.44 34.49,72.95 34.49,66.68 29.32,61.5 29.32,51.39 28.27,50.35 v28.27,49.1 | U3.37 32.84,48.29 32.42,47.87 v32.14,47.87
D8_NEOPIX  (via drill 0.25)
  Top 0.152: v18.03,18.03 27.42,8.65 27.42,5.75 v29.79,3.38 | v18.03,25.65 18.03,28.32 19.1,29.38 19.1,32.56 v28.58,42.04
  Bottom 0.152: U3.32 34.97,43.94 30.48,43.94 v28.58,42.04 | v18.03,18.03 v18.03,25.65 | v29.79,3.38 29.88,3.3 NEOPIX.1
D9
  Bottom 0.152: U3.38 32.84,48.79 32.59,49.04 32.59,50.1 29.64,53.05 29.64,61.39 34.8,66.55 34.8,75.18 32,77.98 MS1.21 MS1.21'
D10
  Bottom 0.152: MS1.22' MS1.22 32,80.52 35.1,77.42 35.1,66.42 29.95,61.27 29.95,53.17 32.83,50.29 U3.41
D11
  Bottom 0.152: MS1.23' MS1.23 31.95,83.06 35.41,79.6 35.41,66.3 30.25,61.14 30.25,53.3 32.77,50.79 U3.42
D12
  Bottom 0.152: MS1.24' MS1.24 32,85.6 35.74,81.86 35.74,66.19 30.56,61.01 30.56,53.43 32.7,51.29 U3.43
D13
  Bottom 0.152: MS1.25' MS1.25 32,88.14 | U3.44 32.63,51.78 30.86,53.55 30.86,60.89 36.04,66.07 36.04,84.1 32,88.14 | 32,88.14 46.29,102.43 46.29,107.26 R10.1
EINK_BUSY  (via drill 0.25)
  Top 0.152: v19.6,85.88 19.86,85.62 22.43,85.62 36.84,71.21 36.84,70.19 v37.59,69.44 | v44.02,59.38 44.79,58.6 v44.79,57.44
  Bottom 0.152: U$2.9 18.84,85.96 18.85,85.98 19.5,85.98 v19.6,85.88 | v37.59,69.44 38.38,68.65 38.38,67.24 38.2,67.06 38.2,65.02 38.5,64.73 42.57,64.73 44.02,63.28 v44.02,59.38 | v44.79,57.44 44.79,55.03 45.72,54.1 45.72,53.59 45.47,53.34 44.87,53.34 U3.2
EINK_CS  (via drill 0.25)
  Top 0.152: v43.43,49.28 43.43,50.93 41.1,53.27 41.1,57.96 v40.92,58.14 | v16.76,84.58 18.54,84.58 18.81,84.32 20.08,84.32 36.96,67.44 v36.96,66.88
  Bottom 0.152: v43.43,49.28 44.8,49.28 U3.10 | U$2.12 16.88,84.46 v16.76,84.58 | v40.92,58.14 41.43,58.66 41.43,63.33 41.21,63.56 38.3,63.56 36.96,64.9 v36.96,66.88
EINK_DC  (via drill 0.25)
  Top 0.152: v43.74,51.31 43.51,51.31 41.4,53.42 41.4,54.56 42.11,55.27 42.11,57.94 v41.91,58.14 | v18.97,84.84 19.15,85.01 22.17,85.01 36.23,70.95 36.23,69.43 v37.59,68.07
  Bottom 0.152: U3.6 43.76,51.29 v43.74,51.31 | U$2.11 18.92,84.96 18.97,84.92 v18.97,84.84 | v41.91,58.14 41.88,58.17 41.88,63.32 41.33,63.86 38.5,63.86 37.59,64.77 v37.59,68.07
EINK_MOSI  (via drill 0.25)
  Top 0.152: v16.76,83.52 33.45,66.83 33.45,62.05 v33.48,62.02 | v36.07,52.07 36.05,52.06 36.05,49.18 v37.32,47.91
  Bottom 0.152: U$2.14 16.82,83.46 v16.76,83.52 | v33.48,62.02 33.48,57.91 34.49,56.9 34.49,54.23 36.07,52.65 v36.07,52.07 | v37.32,47.91 37.36,47.87 U3.28
EINK_RST  (via drill 0.25)
  Top 0.152: v19.05,85.5 19.23,85.32 22.3,85.32 36.54,71.08 36.54,69.81 v37.59,68.75 | v43.52,58.41 44.03,57.9 v44.03,56.94
  Bottom 0.152: U$2.10 19.02,85.46 v19.05,85.5 | v37.59,68.75 38.07,68.27 38.07,67.36 37.9,67.19 37.9,64.9 38.37,64.42 42.44,64.42 43.53,63.33 43.53,58.41 v43.52,58.41 | v44.03,56.94 44.03,54.57 U3.1
EINK_SCK  (via drill 0.25)
  Top 0.152: v19.04,83.83 33.96,68.91 v33.96,62.48 | v38.58,49.1 38.07,49.61 v38.07,50.86
  Bottom 0.152: U$2.13 18.91,83.96 v19.04,83.83 | v33.96,62.48 33.96,62.23 33.96,61.83 33.96,61.82 33.96,57.99 34.8,57.15 34.8,54.37 38.07,51.09 v38.07,50.86 | U3.26 38.37,47.53 39.06,48.23 39.06,48.63 38.78,48.91 38.77,48.91 v38.58,49.1
EN  (via drill 0.25)
  Top 0.152: v8.89,19.6 18.8,29.51 18.8,78.99 18.67,79.12 18.67,79.15 15.51,82.31 15.51,86.36 20.25,91.1 25.84,91.1 v27.69,92.95 27.86,93.13 28.25,93.13 28.34,93.22 v35.31,93.22 | v41.4,99.31 49.28,107.19 v55.88,107.19 56.64,107.95 v56.64,109.83
  Bottom 0.152: U1.3 60.11,110.42 59.52,109.83 v56.64,109.83 55.98,110.49 55.56,110.49 R1.1 | v41.4,99.31 v35.31,93.22 | SW1.P$2 9.53,18.97 v8.89,19.6 | v27.69,92.95 v27.69,92.96 | v27.69,92.96 27.86,93.13 28.25,93.13 28.34,93.22 MS1.27 | MS1.27' 27.04,93.22 27.12,93.13 27.52,93.13 v27.69,92.96
GDR  (via drill 0.25)
  Top 0.152: v13.92,90.22 v11.18,92.96
  Bottom 0.152: v13.92,90.22 14.68,89.46 U$2.2 | v11.18,92.96 10.43,93.71 Q2.1
GND  (via drill 0.25)
  Bottom 0.254: v35.53,50.39 35.53,50.98 35,51.51 35,52.35 34.06,53.29 U3.47
  other vias: 25.15,10.16 27.94,53.09 30.61,50.6 28.19,54.86 35.59,57.81 35.05,45.72 37.67,37.97 34.04,38.35 37.34,41.15 40.13,42.42 37.85,54.1 38.2,52.58 39.6,51.71 40.44,50.32 39.88,46.23 42.67,48.77 41.91,46.23 45.97,34.8 70.1,77.72 50.55,67.31 42.19,63.93 42.16,65.53 42.16,68.07 40,65.53 38.99,62.48 32.21,55.47 46.33,50.88 26.42,102.11 34.54,88.14 47.5,45.21 55.12,44.7 33.53,72.39 33.53,70.08 56.9,111.51 54.61,107.7 51.82,110.24 3.56,99.06 9.14,97.28 12.7,98.04 2.29,57.15 23.88,94.49 66.8,8.64 55.37,104.14 20.07,25.4 18.54,3.05 50.24,48.16 47.5,47.24 75.95,70.1 17.02,7.87 45.47,102.36 45.47,99.31 34.8,109.47
  pour Bottom: 86.61,112.78 0.76,112.78 -2.29,109.73 -2.29,1.27 0.76,-1.78 81.79,-1.78 86.61,3.05
  pour Top: 88.39,111.51 85.85,114.05 -0.25,114.05 -4.06,110.24 -4.06,-3.03 81.81,-3.03 88.39,3.56
MIC_BIAS_PWR  (via drill 0.25)
  Top 0.152: v71.88,20.07 v66.8,20.07
  Bottom 0.152: U7.4 75.4,17.96 73.22,20.13 R22.2 73.09,20.07 v71.88,20.07 | v66.8,20.07 65.6,20.07 R24.2
MICAMP_SHDN
  Bottom 0.152: SJ1.2 63.25,1.02 63.5,0.76 66.29,0.76 66.77,1.24 66.77,6.03 74.75,14.01 U7.6
MISO  (via drill 0.25)
  Top 0.152: v66.8,77.47 63.5,74.17 v58.52,74.17 | v37.9,70.61 38.07,70.43 38.07,67.29 36.06,65.28 v36.06,64.77 | v45.25,75.44 42.42,75.44 v41.66,74.68 | v46.48,41.91 v43.69,41.91
  Bottom 0.152: v43.69,41.91 43.24,42.35 43.24,46.37 35.37,54.25 U3.49 35.37,57.16 34.44,58.08 34.44,63.33 35.88,64.77 v36.06,64.77 | MICROSD.7 68.21,78.88 v66.8,77.47 | v58.52,74.17 54.74,74.17 53.47,75.44 MS1.13' MS1.13 v45.25,75.44 | v41.66,74.68 41.66,74.37 v37.9,70.61 | U6.2 49.91,41.53 49.28,40.89 48.19,40.89 47.17,41.91 v46.48,41.91
MOSI  (via drill 0.25)
  Top 0.152: v44.2,42.93 44.7,42.42 49.02,42.42 v51.08,40.36 | v36.06,64.09 36.54,64.57 36.54,65.33 38.38,67.17 v38.38,72.64 | v41.66,76.2 43.43,77.98 v45.25,77.98
  Bottom 0.152: v44.2,42.93 43.55,43.57 43.55,46.5 35.87,54.18 U3.50 35.87,57.34 36.11,57.59 36.11,64.04 v36.06,64.09 | U6.5 52.45,38.99 v51.08,40.36 | v45.25,77.98 MS1.12 MS1.12' 55.83,77.98 59.38,74.43 72.44,74.43 MICROSD.3 | v38.38,72.64 38.46,72.64 40.79,74.98 40.79,75.34 v41.66,76.2
N$1
  Bottom 0.152: R9.1 18.54,5.55 15.68,2.69 BTN_RESET.P$2
N$2
  Bottom 0.152: D2.A 10.41,104.07 D3.C 8.01,104.47 C24.2
N$3  (via drill 0.25)
  Top 0.152: v11.18,96.01 v9.14,96.01
  Bottom 0.152: C24.1 6.21,100.77 D4.A 4.57,100 4.57,97.41 5.24,96.75 L1.P$2 7.34,96.01 v9.14,96.01 | Q2.3 v11.18,96.01
N$4  (via drill 0.25)
  Top 0.152: v27.56,106.43 31.24,110.11 v31.24,110.24
  Bottom 0.152: R4.1 26.14,106.96 26.67,106.43 v27.56,106.43 | CHG.C 31.5,110.49 v31.24,110.24
N$7
  Bottom 0.152: LED.A 46.77,108.89 R10.2
N$9  (via drill 0.25)
  Top 0.152: v22.1,105.41 28.45,105.41 31.12,108.08 v33.02,108.08
  Bottom 0.152: R5.1 21.66,105.41 v22.1,105.41 | FUL.A 33.53,108.58 v33.02,108.08
N$15
  Bottom 0.152: R20.2 54.81,25.28 54.81,25.93 53.53,27.2 R19.1 53.53,27.41 52.07,25.95 C31.1
N$65
  Bottom 0.152: R21.2 73.79,22.03 73.41,22.03 R22.1 72.51,22.03 C32.1
N$67
  Bottom 0.152: C33.2 63.63,20.13 R24.1 67.43,20.13 R23.2 68.07,20.07 68.86,19.28 73.18,19.28 74.1,18.36 U7.2
N$68
  Bottom 0.152: U7.3 74.57,17.33 74.57,16.88 74.36,16.68 71.14,16.68 C34.2 R26.1 R25.1
N$69
  Bottom 0.152: R25.2 C35.1
N$70
  Bottom 0.152: R18.2 57.15,25.87 58.49,27.2 R17.1 58.49,27.39 59.94,25.94 C30.1
PB31_SWO_MICSHDN  (via drill 0.25)
  Top 0.152: v40.61,53.77 40.61,52.88 41.58,51.91 41.58,47.83 44.96,44.45 v46.48,44.45 | v59.44,19.56 59.44,34.12 50.62,42.93 v47.75,42.93
  Bottom 0.152: U3.60 40.87,54.02 v40.61,53.77 | v47.75,42.93 47.75,43.18 v46.48,44.45 | SJ1.1 61.42,3.3 59.22,5.5 59.22,7.89 59.94,8.61 59.94,19.05 v59.44,19.56
PREVGH  (via drill 0.25)
  Top 0.152: v13.72,95.76 13.17,95.76 v10.38,98.55
  Bottom 0.152: D4.C 5.76,102.52 7.96,102.52 8.85,101.62 8.85,100.08 v10.38,98.55 | U$2.21 16.05,79.96 13.21,82.8 13.21,93.15 C23.1 13.72,95.32 v13.72,95.76
PREVGL
  Bottom 0.152: D3.A 11.06,100.77 C22.1 13.76,97.28 13.21,96.73 13.21,93.59 12.9,93.28 12.9,82.68 16.62,78.96 U$2.23
PROG
  Bottom 0.152: R3.1 U2.5
QSPI_CS  (via drill 0.25)
  Top 0.152: v39.33,43.09 39.07,42.82 v36.78,42.82 | v26.42,37.59 31.5,37.59 v32.13,38.23
  Bottom 0.152: v26.42,37.59 26.42,37.53 R11.2 25.47,35.56 24.51,34.6 U4.1 | U3.24 39.37,43.12 v39.33,43.09 | v36.78,42.82 32.18,38.23 v32.13,38.23
QSPI_DATA[0]
  Bottom 0.152: U4.5 28.32,29.4 33.28,34.37 40.46,34.37 42.87,36.77 U3.17
QSPI_DATA[1]
  Bottom 0.152: U4.2 25.76,33.35 25.76,34.43 26.93,35.6 28.08,35.6 28.88,36.4 40.59,36.4 42.37,38.17 U3.18
QSPI_DATA[2]  (via drill 0.25)
  Top 0.152: v41.25,36.35 41.88,36.98 v41.88,39.17
  Bottom 0.152: U4.3 27.03,33.35 27.03,34.1 29,36.07 40.97,36.07 v41.25,36.35 | v41.88,39.17 41.88,44.32 U3.19
QSPI_DATA[3]  (via drill 0.25)
  Top 0.152: v40.13,37.34 40.13,35.99 v39.73,35.59
  Bottom 0.152: U4.7 25.71,28.2 25.71,29 32.47,35.76 39.55,35.76 v39.73,35.59 | U3.20 41.4,44.3 41.4,38.61 v40.13,37.34
QSPI_SCK  (via drill 0.25)
  Top 0.152: v37.87,35.15 38.98,36.26 v38.98,37.34
  Bottom 0.152: U4.6 27.03,28.16 27.03,29.33 32.85,35.15 v37.87,35.15 | v38.98,37.34 38.98,40.89 39.36,41.28 39.36,42.43 39.88,42.95 39.88,44.33 U3.23
RESE  (via drill 0.25)
  Top 0.152: v13.9,89.56 11.78,91.68 11.78,91.9 11.29,92.38 10.67,92.38 9.91,93.14 v9.91,93.22
  Bottom 0.152: v13.9,89.56 14.49,88.96 U$2.3 | R12.1 8.21,99.19 Q2.2 9.75,96.28 9.75,93.37 v9.91,93.22
RX  (via drill 0.25)
  Top 0.152: v34.54,49.78 34.54,53.32 v33.52,54.35 | v33,61.21 33.32,61.54 34.2,61.54 36.85,64.19 36.85,64.93 v38.73,66.82 | v42.16,72.9 v46.46,72.9 | JP1.3 17.53,97.54 32.18,97.54 37.34,92.38 v37.34,83.06
  Bottom 0.152: MS1.14' MS1.14 v46.46,72.9 | U3.40 v34.54,49.79 v34.54,49.78 | v33.52,54.35 33.52,54.6 32.87,55.25 32.87,59.84 32.51,60.2 32.51,60.73 v33,61.21 | v38.73,66.82 41.27,69.35 41.27,72 v42.16,72.9 42.93,73.66 42.93,77.47 v37.34,83.06
SCK  (via drill 0.25)
  Top 0.152: v50.72,39.27 49.87,40.13 35.05,40.13 33.53,41.66 v33.53,44.7 | v63.75,79.5 63.25,80.01 v59.44,80.01 | v40.32,52.06 40.32,51.93 40.97,51.29 40.97,49.91 39.49,48.43 v38.58,48.43 | v37.62,48.55 36.87,49.3 v36.78,49.3 | v50.55,80.52 50.55,71.01 51.9,69.65 51.9,63.87 42.54,54.51 v42.54,54.26
  Bottom 0.152: MS1.11 v50.55,80.52 MS1.11' 53.21,80.01 v59.44,80.01 | v50.72,39.27 51.18,38.82 U6.6 | v33.53,44.7 33.53,44.96 32.51,45.98 32.51,47.5 32.8,47.79 U3.36 34.3,47.79 34.34,47.83 35.3,47.83 v36.78,49.3 | MICROSD.5 66.58,76.68 v63.75,79.5 | v42.54,54.26 40.35,52.06 v40.32,52.06 | v38.58,48.43 37.74,48.43 v37.62,48.55
SCL  (via drill 0.25)
  Top 0.152: v17.27,56.64 14.73,54.1 v10.67,54.1 | v36.32,46.97 34.82,48.46 30.36,48.46 19.77,59.05 v19.69,59.05
  Bottom 0.152: MS1.18 28.34,70.36 28.25,70.44 27.12,70.44 27.04,70.36 MS1.18' 25.27,70.17 23.01,67.91 23.01,62.38 v19.69,59.05 v17.27,56.64 | v10.67,54.1 7.3,54.1 PORT_I2C.4 | v36.32,46.97 36.37,46.97 U3.30
SDA  (via drill 0.25)
  Top 0.152: v36.83,47.47 35.53,48.77 30.73,48.77 v20.45,59.05
  Bottom 0.152: MS1.17 28.34,67.82 28.25,67.73 27.12,67.73 27.04,67.82 MS1.17' 24,67.82 23.52,67.33 23.52,62.13 v20.45,59.05 16,54.61 11.43,54.61 9.89,56.15 PORT_I2C.3 | U3.29 36.87,47.47 v36.83,47.47
SDCS  (via drill 0.25)
  Top 0.152: v36.25,43.26 36.5,43.26 37.21,43.97 49.22,43.97 73.66,68.41 v73.66,73.41
  Bottom 0.152: U3.31 35.87,43.64 v36.25,43.26 | v73.66,73.41 73.63,73.38 MICROSD.2
SHIELD
  Bottom 0.254: J2.S1 35.66,108.61 35.66,110.66 J2.S6 J2.S4 J2.S3 J2.S5 42.57,110.66 42.57,108.61 J2.S2 42.32,106.72 C36.1 R27.1
STAT
  Bottom 0.152: U2.1 20.19,108.78 R5.2 24.17,106.93 R4.2
SWCLK  (via drill 0.25)
  Top 0.152: v39.42,57.43 39.07,57.78 37.72,57.78 36.93,58.57 35.48,58.57 32.86,55.96 29.36,55.96 28.83,55.42 27.2,55.42 26.77,55.86 v24.37,55.86 | v16,46.99 16,41.66 v14.99,40.64 | v29.72,41.91 v20.07,51.56
  Bottom 0.152: TP6.P$1 8.38,29.46 6.1,29.46 5.59,29.97 X2.4 5.59,32.37 7.52,34.3 7.52,37.33 8.16,37.97 12.31,37.97 v14.99,40.64 | U3.57 39.37,57.37 v39.42,57.43 | v24.37,55.86 v20.07,51.56 16,47.5 v16,46.99 | R7.2 31.53,40.1 v29.72,41.91
SWDIO  (via drill 0.25)
  Top 0.152: v39.85,56.74 38.93,56.74 38.3,57.38 36.61,57.38 35.13,55.91 33.96,55.91 33.05,54.99 32.1,54.99 31.26,54.15 27.3,54.15 27.12,54.33 26.72,54.33 26.55,54.15 26.08,54.15 v25.13,55.1 | v2.79,37.85 4.57,39.62 14.99,39.62 17.02,41.66 v17.02,46.99
  Bottom 0.152: TP7.P$1 4.32,30.48 X2.2 2.79,33.16 v2.79,37.85 | U3.58 39.87,56.73 v39.85,56.74 | v25.13,55.1 v17.02,46.99
SWO  (via drill 0.25)
  Top 0.152: v59.44,2.03 v61.47,4.06 | v14.48,5.59 v18.03,2.03
  Bottom 0.152: X2.6 7.52,30.97 7.52,30.24 7.65,30.1 9.48,30.1 10.88,28.7 10.88,27.61 14.48,24.01 v14.48,5.59 | v59.44,2.03 57.86,0.46 19.61,0.46 v18.03,2.03 | v61.47,4.06 62.23,4.83 SJ1.5
TX  (via drill 0.25)
  Top 0.152: v34.95,49.25 35.03,49.33 35.03,53.77 v33.99,54.81 | v33,60.4 33.84,61.24 34.32,61.24 37.21,64.12 37.21,64.36 v38.73,65.88 | v46.46,70.36 43.27,70.36 v42.25,69.34 41.4,70.19 v41.4,72.9 | JP1.1 21.79,98.35 32.56,98.35 38.23,92.68 v38.23,80.9
  Bottom 0.152: MS1.15' 51.2,70.36 51.11,70.44 49.98,70.44 49.9,70.36 MS1.15 v46.46,70.36 | U3.39 34.91,49.29 v34.95,49.25 | v33.99,54.81 33.99,56.97 33.17,57.79 33.17,60.22 v33,60.4 | v42.25,69.34 42.19,69.34 v38.73,65.88 | v38.23,80.9 42.62,76.5 42.62,74.12 v41.4,72.9
UNIFONT_CS  (via drill 0.25)
  Top 0.152: v49.28,47.24 49.28,47.75 v48.77,48.26
  Bottom 0.152: U3.9 47.24,49.79 v48.77,48.26 | U6.1 48.64,46.61 v49.28,47.24
USB_N  (via drill 0.25)
  Top 0.152: v31.34,57.07 31.34,57.23 31.6,57.48 31.6,57.94 39.22,65.56 39.22,104.04 38.86,104.39 v38.86,104.65
  Bottom 0.152: U3.45 32.56,52.29 31.17,53.68 31.17,56.9 v31.34,57.07 | J2.2 38.47,105.04 v38.86,104.65
USB_P  (via drill 0.25)
  Top 0.152: v32,57.07 32,57.4 31.9,57.51 31.9,57.81 39.52,65.43 39.52,104.06 39.73,104.27 39.73,104.44 v39.52,104.65
  Bottom 0.152: U3.46 32.51,52.79 31.47,53.83 31.47,55.85 32,56.39 v32,57.07 | J2.3 39.12,107.11 38.86,106.85 38.86,105.57 39.52,104.91 v39.52,104.65
V+
  Bottom 0.305: Q1.2 53.17,110.98 R1.2 53.41,110.06 55.01,108.46 D1.C 58.1,108.46 C1.1 58.67,108.52 U1.1
VBAT  (via drill 0.3)
  Top 0.305: v33.27,100.58 34.54,101.85 | 34.54,101.85 34.54,105.74 33.02,107.26 v31.5,107.26 | 34.54,101.85 40.89,108.2 v48.77,108.2
  Bottom 0.305: MS1.28' 26.93,95.76 27.09,95.92 27.69,95.92 | 27.69,95.92 28.28,95.92 28.44,95.76 MS1.28 | 27.69,95.92 27.69,97.92 X1.2 | X1.2 22.62,100.6 | 22.62,100.6 20.12,98.09 R6.8 | X1.2 33.26,100.6 v33.27,100.58 | C4.1 30.72,107.26 v31.5,107.26 | v48.77,108.2 49.55,108.98 Q1.3 | U2.3 18.22,110.68 17.78,110.24 17.78,105.44 22.62,100.6
VBUS  (via drill 0.3)
  Top 0.305: v38.35,109.43 48.21,109.43 v48.77,109.98 | v25.4,91.95 25.4,93.83 23.37,95.86 v19.23,95.86
  Bottom 0.305: 34.54,106.68 37.12,106.68 37.82,107.37 J2.1 37.82,108.89 v38.35,109.43 | 34.54,106.68 33.02,106.68 | 33.02,106.68 28.7,106.68 26.67,108.71 R2.1 26.67,108.8 25.77,109.7 23.28,109.7 22.31,110.68 U2.4 | D1.A 51.84,108.46 49.32,110.98 Q1.1 48.77,110.92 v48.77,109.98 | 34.54,106.68 34.54,92.71 32.51,90.68 MS1.26 MS1.26' 25.4,90.81 v25.4,91.95 | R6.6 v19.23,95.86 | CHG.A 31.5,108.2 33.02,106.68
VCOM
  Bottom 0.152: U$2.24 18.63,78.46 C21.2
VDD
  Bottom 0.152: U$2.18 17.93,81.44 18.57,81.44 19.33,82.19 19.33,82.76 C18.2
VDDCORE2
  Bottom 0.305: U3.53 C8.1 C7.1
VGH
  Bottom 0.152: U$2.5 19.45,87.96 C16.2
VGL
  Bottom 0.152: U$2.4 18.61,88.46 19.3,89.15 19.3,90.36 C15.2
VSH
  Bottom 0.152: U$2.20 18.81,80.46 19.88,81.53 C19.2
VSL
  Bottom 0.152: U$2.22 20.17,79.46 C20.2

## Text on the board
tPlace: Project info: | RX | GND | TX | 3V | oddlyspecific.org/book | BUILDING YOUR BOOK | NOTE: This project requires some surface mount soldering. You may be / able to make do with a soldering iron, flux and wick, but a reflow oven is / ideal. The only really fine-pitched parts are the SAMD51 and the flex cable / connector; other than that, most chips are wide-pitch SOIC, and all resistors / and capacitors are 0805 or larger so you can place them by eye with fine / tweezers. All surface mount parts are on one side (the back). / / The board is arranged in `blocks' surrounded by dotted lines. All / parts within a block are related to that block's function. Example: / in the `Button Register' block, U5 is the shift register, C26 is a / decoupling capacitor for the shift register, and R13 and R14 are / pull-up and pull-down resistors for the shift register inputs. If / you were to omit everything in this block, the device would still / function, just without the buttons. / / At bare minimum, you need to populate the `Power Supply' and / `SAM D51 Microcontroller' blocks, and probably `Reset Button'. / You almost certainly also want `Battery and Charging' to take book on the go. / Note that the Feather headers are `inside' this block, but you can choose to / add those or not separately. A 400mAh battery fits nicely in the gap between / the headers, atop the lazer bear. / / From here, baseline functionality comes from the `E-Paper Display', `MicroSD' / and `Button Register' blocks. This is probably the minimum viable book. / / From here, populate: / * The `2MB QSPI Flash' & `Status LED' blocks if you plan to use CircuitPython. / * The `Babel Flash Chip' block for universal language support with Babel. / * The `Extra Ports' block to add STEMMA-compatible I²C and analog connectors. / * The `Audio Combo Jack' block to add stereo audio output, and raw mic input / from the inline mic on A7. If you do this, you can also populate: / * The `+Mic Preamp' block for amplified microphone input on A10. / / There's also a `Lock Button' and a `Serial Port' at the top; the lock button is / connected directly to an interrupt pin on the SAMD51, and you can solder / some socket header onto the serial port for access to the UART pins. / / Populate your board. If you are using a reflow oven, reflow BEFORE attaching / the e-paper screen or soldering any thru-hole components. Once that's done, / use a multimeter to ensure that there are no short circuits between 3V, VBUS, / VBAT and GND. Inspect all parts for bridged pins. When all looks good, flash / the UF2 bootloader using a SWD programmer such as a J-Link, Atmel-ICE, or / even a Feather running Adafruit_DAP. You should now be able to / double-tap the reset button and see the red LED pulse. / / Unplug your device. Now you can solder on the thru-hole components. / / Finally: using the Arduino IDE, upload the Open Book screen test sketch, and / then unplug your device. Thread the screen's flex cable through the hole up / top, and secure it in the flex connector. Power up the device. If you see the / screen refresh, you're done! Secure the screen to this area with double sided / tape; you don't need this documentation anymore. | THE OPEN BOOK | OSO-BOOK-A1-05
bPlace: SERIAL PORT | RX | GND | TX | 3V | LOCK_BUTTON=D51=PA27 | E-PAPER DISPLAY | & | BATTERY / CHARGING | POWER SUPPLY | Notes / at end / of the / POWER / SUPPLY / block. | RESET | D1, Q1&R2 conspire to / let only the higher of VBAT and / VBUS reach 3.3V regulator U1. C1 / filters regulator input; C2 & C3 / filter output. R1 pulls EN high / to keep the regulator on. / BATTERY: U2 is a LiPo charging / controller. Powered by VBUS, it / charges the battery at a rate / determined by R3. C4=filter for / VBAT, R4&R5 limit current to CHG / & FUL LEDs. R6: voltage dividers / to gauge VBAT and VBUS / on A6/PB01 and A11/PB00. | 3V | AREF / PA03 | GND | VBAT | A0 / PA02 | BTN_PREV_ALT | EN | A1 / PA05 | VBUS | A2 / PB08 | LED / D13 / PA23 | A3 / PB09 | R3 Values | 10K = 100mA <- RECOMMEND!!! / 5K = 200mA 2K = 500mA | BTN_NEXT_ALT | D12 / PA22 | A4 / PA04 | D11 / PA21 | A5 / PA06 | WARNING: OVER 100mA, BE ABSOLUTELY CERTAIN / THAT YOUR BATTERY SUPPORTS THE DESIRED / RATE OF CHARGE!! PLEASE DON'T CATCH FIRE. | D10 / PA20 | SCK / PA17 | D9 / PA19 | MOSI / PB23 | Pins: ECS=D44/PB07 EDC / =D45/PB05 ERST=D46 / /PA00 EBSY=D47/PA01 | D6 / PA18 | MISO / PB22 | D5 / PA16 | THE OPEN | RX / PB17 | GND | 3V | SCL / PA13 | BOOK | TX / PB16 | A9 | SDA / PA12 | GND | Uses the main SPI / bus (MISO, MOSI, SCK). / SDCS is D4/PA14. | MICROSD | SAM D51 MICROCONTROLLER | STATUS LED | NEOPIXEL=D8= / PA15 (it's @ / bottom by / RESET. | Lots to unpack here. For starters, the Feather / pinout is mostly identical to the Adafruit SAMD51 / boards you're familiar with, PWM & analog pins / where you expect them (minus ``extra'' pin D4). / SERCOM5: Serial (RX/TX = D0/D1 = PB17/PB16) / SERCOM1: SPI (MOSI/MISO/SCK = D27/D26/D28 = PB23/PB22/PA17) / SERCOM2: I²C (SDA/SCL = D24/D25 = PA12/PA13) / SERCOM4: SPI for the display: / MOSI1/SCK1 = D41/D42 = PB15/PB13 / (no need for a MISO1). / For CircuitPython, use pin names / (i.e. SCK, D8, A4). Arduino: number / after D is digital pin number (D4=4), / & for analog pins, use number with `A' prefix / (A0). Most folks can ignore pad names (PA12), / but they're useful for firmware development. | GND | 3V | SDA | C7&C8: filter | SCL | caps on VDDCORE, / output from the / chip's voltage / regulator. | GND | 3V | plz don't steal the bear tho. | THE OPEN BOOK IS / OPEN SOURCE HARDWARE! / CC-BY-SA 4.0 | BABEL FLASH CHIP | C5, C6, C9, C10: filtering / caps on each power pin | A8 | U6 is a GD25Q16C Flash chip on / the main SPI bus (BCS: D52/PB06). / Fits Unicode character data and / Unifont glyphs for every codepoint / in the Basic Multliingual Plane. | The center port provides an I²C interface. The other / two ports provide access to pins A8 and A9 (PB03 & / PB02, respectively) via current limiting resistors R15 / & R16. D5 & D6 are 3.6V zener diodes to protect pins / from overvoltage: they shunt excess power to ground / when the voltage exceeds their breakdown point. | EXTRA PORTS (JST-PH) | C11 & C12 filter AVCC/ / AREF, isolated by FB1 | 2MB QSPI FLASH | AUDIO COMBO JACK | U4 is another GD25Q16C Flash / chip. It's the CIRCUITPY drive / that shows up when you plug / it in! It's on a dedicated QSPI / bus (PB10, PB11, PA08-PA11). / CircuitPy uses this internally; / Arduino can use it with SCK 35, / CS 36 and data lines 37-40. | These resistors and capacitors couple / analog outputs A0/PA02 and A1/PA05 / to R and L channels of the audio jack. / A7/PB04 is raw signal from mic input. | SWDIO | GND | 3V3 | SWCLK | RESET | +MIC PREAMP | COLOPHON | Connector and test / points give access / to SWD interface. / R7=SWCLK pullup. / See note in mic / block about SWO. | DEBUG PORT | U7 is a MAX4468 amp / for an inline electret / mic (amplified signal... | The Open Book by Joey Castillo / @josecastillo. Based in large / part on @Adafruit's awesome / open source designs! OSO logo / & lazer bear by Joseph Devens, / @DoctorDevens. Thanks to Tom F, / Josh L, Brent R, OSHPark & many / others. Made with . in BK & TX. | BUTTON REGISTER | U5 is a 74165 8-bit / shift register. It takes / the state of 7 of the / board's buttons (L/D/U/R / /Sel/Prev/Next) and fits / them in a single byte. | Ferrite bead / FB2 isolates / AGND from GND. | ENABLE SWITCH | R1 up top pulls EN high. / Switching SW1 pulls EN / low, disabling pwr / supply U1 (along with / most of the board.) | ...on A10/PA07. Turn / the amplifier off by / setting D48/PB31 high. / This also powers down / the mic bias / circuit / to save some power. | RESET BUTTON | R8: pull-up for !RESET!. / Btn pulls it / low; C13&R9 / help. Double / tap for UF2 / bootloader. | Bits: / 0: Left / 1: Down / 2: Up / 3: Rt / 4: Sel / 5: Prev / 6: Next / 7: SD | (R21-C33) | NOTE: PB31 can do SWO. If you / need it (tho you prolly don't): / . cut trace btwn PB31 & / SHDN, & connect it / to SWO. Now tie / SHDN to ENA or / . DISA to keep the / amp on (or off). | SWO | BTN_RESET | PB31 | card / detect | BUTTON_CLOCK=D53=PB14 / BUTTON_OUT=D49=PB30 / BUTTON_LATCH=D43=PB12 | ENA | SHDN | DISA